# Altium schematic sheet PWR_Management_2026-06-21.schdoc
size 170 x 162 mm
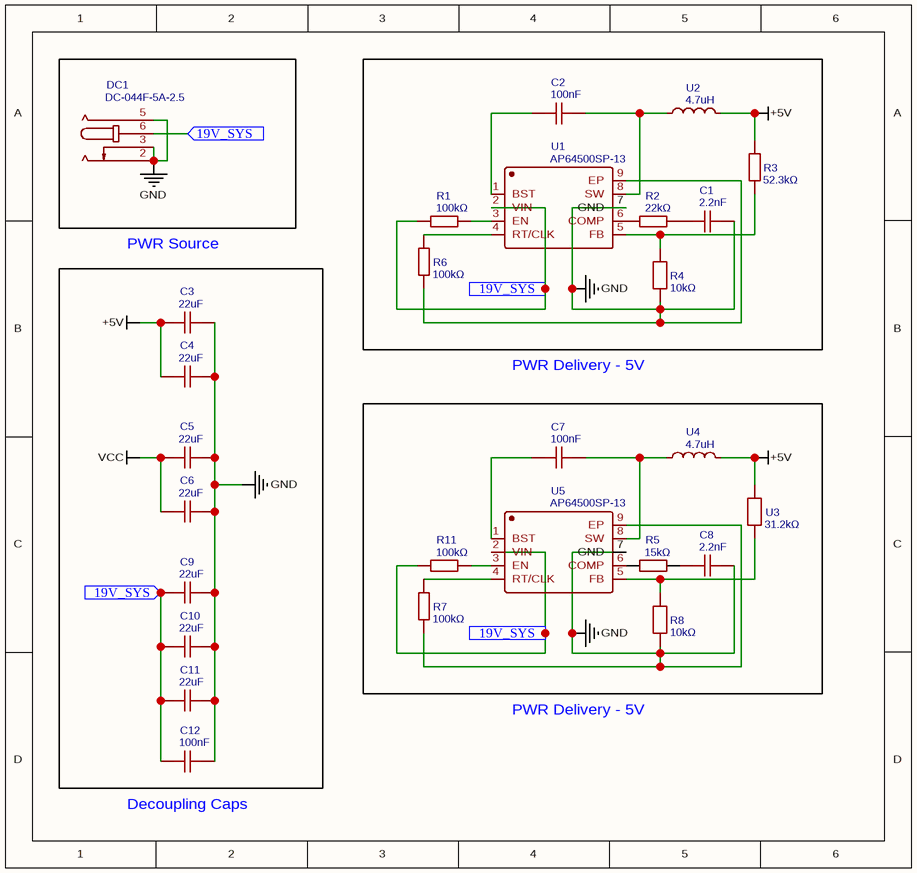
[diagram p0: PWR_Management_2026-06-21.schdoc]

## Parts
C1  2.2nF  [C0603]
C2  100nF  [C0603]
C3  22uF  [C0603]
C4  22uF  [C0603]
C5  22uF  [C0603]
C6  22uF  [C0603]
C7  100nF  [C0603]
C8  2.2nF  [C0603]
C9  22uF  [CAP-SMD_L6.1-W5.3-L]
C10  22uF  [CAP-SMD_L6.1-W5.3-L]
C11  22uF  [CAP-SMD_L6.1-W5.3-L]
C12  100nF  [C0603]
DC1  DC-044F-5A-2.5  [DC-IN-TH_DC-044F-5A-2.5]
R1  100kΩ  [R0603]
R2  22kΩ  [R0603]
R3  52.3kΩ  [R0603]
R4  10kΩ  [R0603]
R5  15kΩ  [R0603]
R6  100kΩ  [R0603]
R7  100kΩ  [R0603]
R8  10kΩ  [R0603]
R11  100kΩ  [R0603]
U1  AP64500SP-13  [SO-8_L4.9-W3.9-P1.27-LS6.0-BL-EP]
U2  4.7uH  [IND-SMD_L7.0-W6.6_APH0630]
U3  31.2kΩ  [R0603]
U4  4.7uH  [IND-SMD_L7.0-W6.6_APH0630]
U5  AP64500SP-13  [SO-8_L4.9-W3.9-P1.27-LS6.0-BL-EP]

## Blocks framed on the sheet
PWR Source: C3-C6 C9-C12

## Ports
19V_SYS (in)

## Nets
+5V: C3.1 C4.1 R3.1 U2.2 U3.2 U4.2
GND: C1.2 C3.2 C4.2 C5.2 C6.2 C8.2 C9.2 C10.2 C11.2 C12.2 DC1.2 DC1.3 DC1.5 R4.1 R6.1 R7.1 R8.1 U1.7(GND) U1.9(EP) U5.7(GND) U5.9(EP)
VCC: C5.1 C6.1
19V_SYS: C9.1 C10.1 C11.1 C12.1 DC1.6 R1.1 R11.1 U1.2(VIN) U5.2(VIN) ; port 19V_SYS
NetC1_1: C1.1 R2.2
NetC2_1: C2.1 U1.1(BST)
NetC2_2: C2.2 U1.8(SW) U2.1
NetC7_1: C7.1 U5.1(BST)
NetC7_2: C7.2 U4.1 U5.8(SW)
NetC8_1: C8.1 R5.2
NetR1_2: R1.2 U1.3(EN)
NetR2_1: R2.1 U1.6(COMP)
NetR3_2: R3.2 R4.2 U1.5(FB)
NetR5_1: R5.1 U5.6(COMP)
NetR6_2: R6.2 U1.4(RT/CLK)
NetR7_2: R7.2 U5.4(RT/CLK)
NetR8_2: R8.2 U3.1 U5.5(FB)
NetR11_2: R11.2 U5.3(EN)

## Notes on the sheet
- PWR Delivery - 5V
- (near C12) Decoupling Caps

## Library data of the parts
C1 C8 = 2.2nF: Manufacturer: FOJAN(富捷); Manufacturer Part: FCC0603B222K500CT; nameAlias: Value; Contributor: lcsc; Supplier: LCSC; Supplier Part: C5137562; JLCPCB Part Class: Extended Part; spicePre: C; spiceSymbolName: FCC0603B222K500CT
C2 C7 C12 = 100nF: Manufacturer: muRata(村田); Manufacturer Part: GRM188R71H104KA93D; nameAlias: Value; Supplier: LCSC; Supplier Part: C77055; JLCPCB Part Class: Extended Part; spicePre: C; spiceSymbolName: GRM188R71H104KA93D
C3-C6 = 22uF: Manufacturer: Chinocera(华瓷); Manufacturer Part: HGC0603R5226M160NTHJ; nameAlias: Value; Contributor: lcsc; Supplier: LCSC; Supplier Part: C22367828; JLCPCB Part Class: Extended Part; spicePre: C; spiceSymbolName: HGC0603R5226M160NTHJ
C9-C11 = 22uF: Manufacturer: muRata(村田); Manufacturer Part: KCM55QR71H226KH13K; nameAlias: Value; Contributor: lcsc; Supplier: LCSC; Supplier Part: C6579204; JLCPCB Part Class: Extended Part; spicePre: C; spiceSymbolName: KCM55QR71H226KH13K
DC1 = DC-044F-5A-2.5: Manufacturer: XKB Connection(中国星坤); Contributor: lcsc; Supplier: LCSC; Supplier Part: C779941; Manufacturer Part: DC-044F-5A-2.5; JLCPCB Part Class: Extended Part; spicePre: D; spiceSymbolName: DC-044F-5A-2.5
R1 R6 R7 R11 = 100kΩ: Manufacturer: FH(风华); Manufacturer Part: RS-03K1003FT; nameAlias: Value; Contributor: LCSC; Supplier: LCSC; Supplier Part: C115320; JLCPCB Part Class: Extended Part; spicePre: R; spiceSymbolName: RS-03K1003FT_C115320
R2 = 22kΩ: Manufacturer: FH(风华); Manufacturer Part: RS-03K2202FT; nameAlias: Value; Contributor: LCSC; Supplier: LCSC; Supplier Part: C286577; JLCPCB Part Class: Extended Part; spicePre: R; spiceSymbolName: RS-03K2202FT
R3 = 52.3kΩ: Manufacturer: FH(风华); Manufacturer Part: RS-03K5232FT; nameAlias: Value; Contributor: LCSC; Supplier: LCSC; Supplier Part: C304764; JLCPCB Part Class: Extended Part; spicePre: R; spiceSymbolName: RS-03K5232FT
R4 R8 = 10kΩ: Manufacturer: Viking(光颉); Manufacturer Part: AR03BTS1002; nameAlias: Value; Contributor: lcsc; Supplier: LCSC; Supplier Part: C20607729; JLCPCB Part Class: Extended Part; spicePre: R; spiceSymbolName: AR03BTS1002
R5 = 15kΩ: Manufacturer: LIZ(丽智电子); Manufacturer Part: CR0603FA1502G; nameAlias: Value; Supplier: LCSC; Supplier Part: C100780; JLCPCB Part Class: Extended Part; spicePre: R; spiceSymbolName: CR0603FA1502G
U1 U5 = AP64500SP-13: Manufacturer: DIODES(美台); Contributor: LCSC; Supplier: LCSC; Supplier Part: C2070920; Manufacturer Part: AP64500SP-13; JLCPCB Part Class: Extended Part; spicePre: U; spiceSymbolName: AP64500SP-13
U2 U4 = 4.7uH: Manufacturer: APV(爱普微); Manufacturer Part: APH0630T4R7M; nameAlias: Value; Contributor: lcsc; Supplier: LCSC; Supplier Part: C5349705; JLCPCB Part Class: Extended Part; spicePre: U; spiceSymbolName: APH0630T4R7M
U3 = 31.2kΩ: Manufacturer: YAGEO(国巨); Manufacturer Part: RT0603DRE0731K2L; nameAlias: Value; Contributor: lcsc; Supplier: LCSC; Supplier Part: C863036; JLCPCB Part Class: Extended Part; spicePre: U; spiceSymbolName: RT0603DRE0731K2L